# EAGLE design ReflowController_v1.1 (EAGLE 6.3)
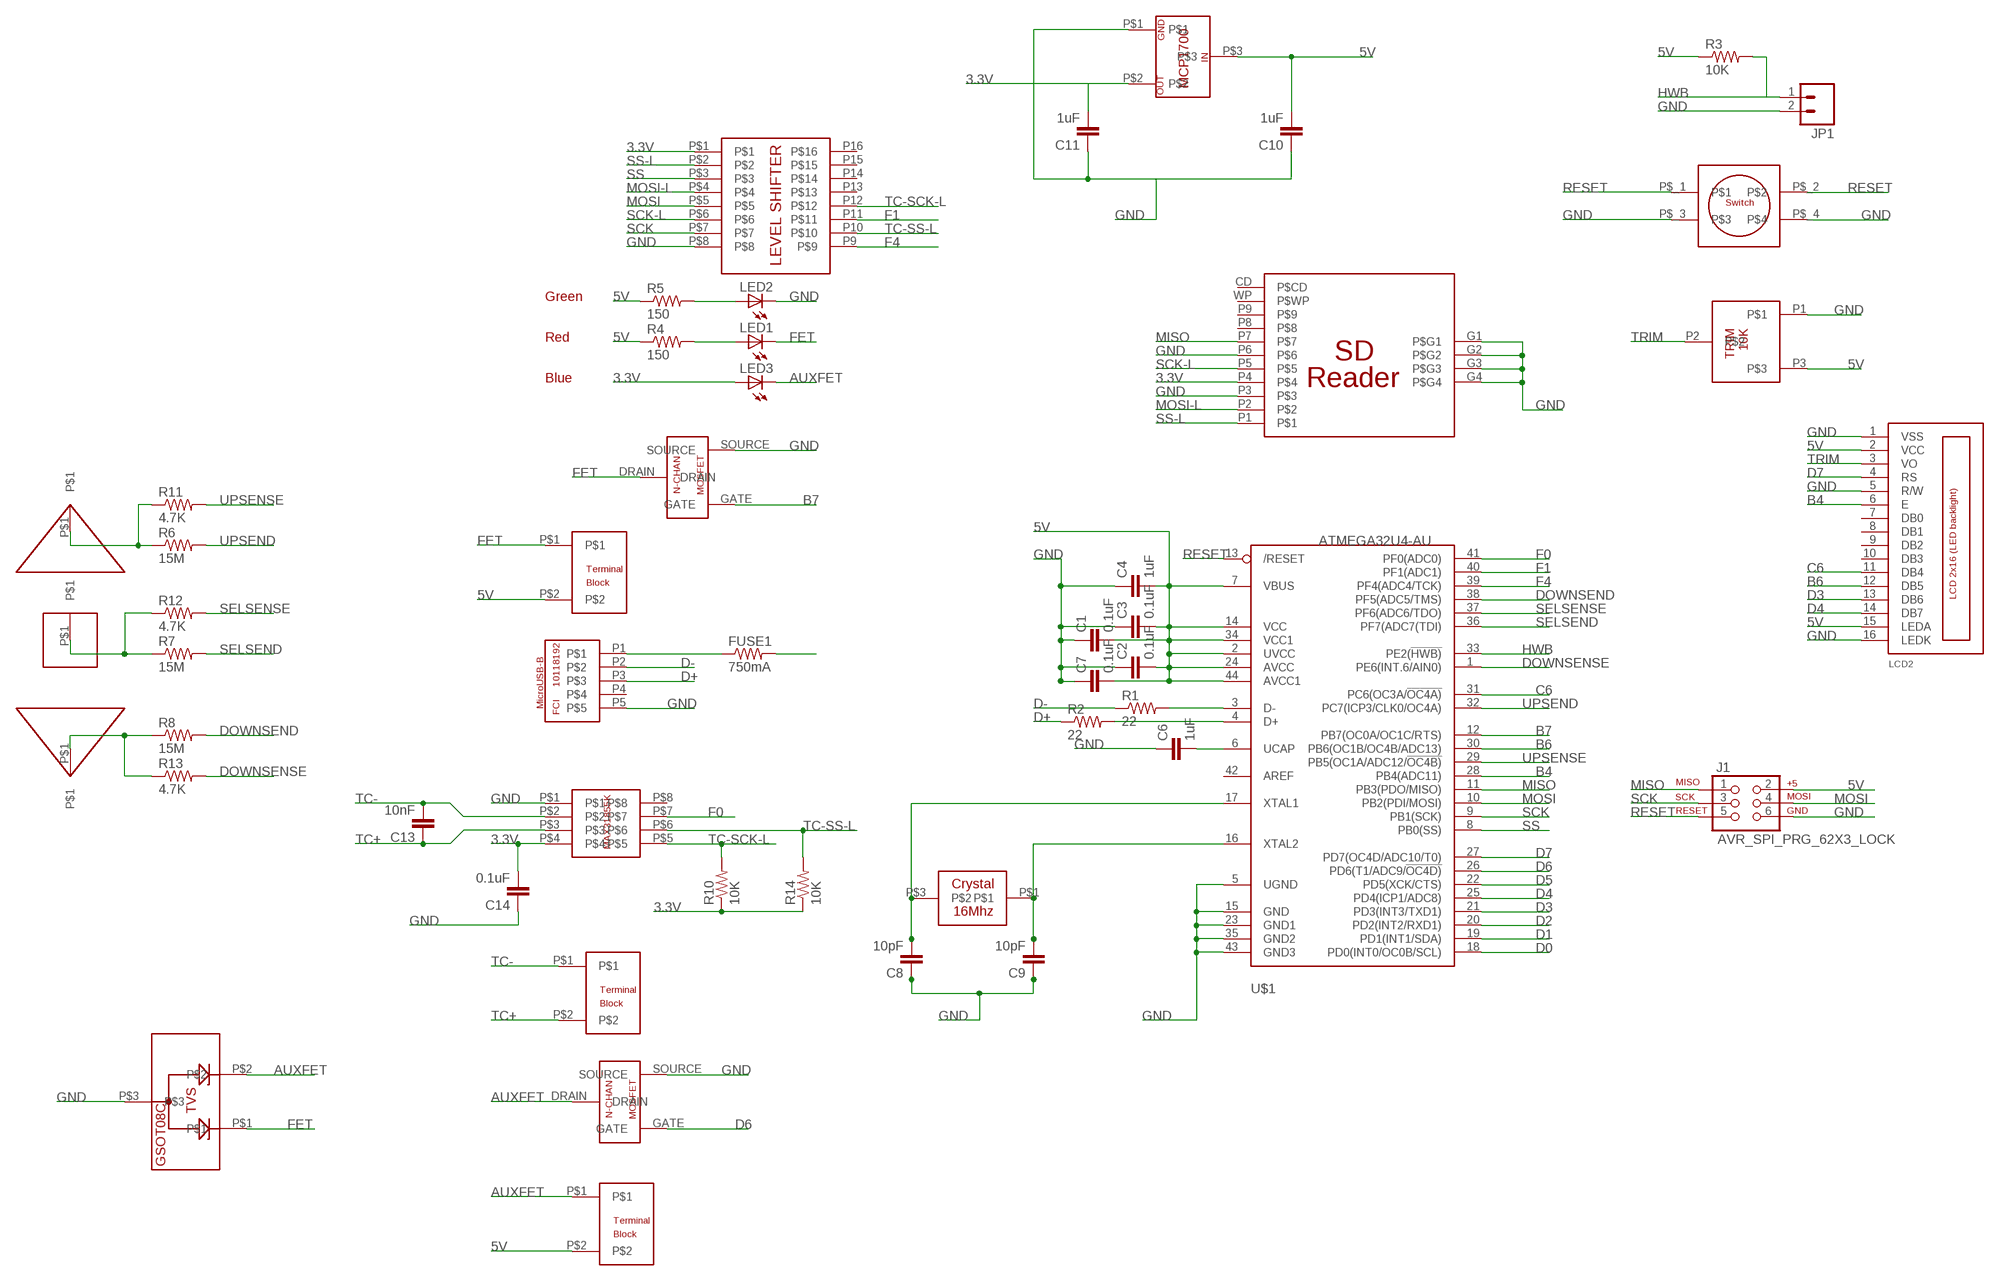
[diagram p0: schematic, sheet 1]

## Parts
C1  0.1uF  CAP0603-CAP  [0603-CAP]
C2  0.1uF  CAP0603-CAP  [0603-CAP]
C3  0.1uF  CAP0603-CAP  [0603-CAP]
C4  1uF  CAP0603-CAP  [0603-CAP]
C6  1uF  CAP0603-CAP  [0603-CAP]
C7  0.1uF  CAP0603-CAP  [0603-CAP]
C8  10pF  CAP0603-CAP  [0603-CAP]
C9  10pF  CAP0603-CAP  [0603-CAP]
C10  1uF  CAP0603-CAP  [0603-CAP]
C11  1uF  CAP0603-CAP  [0603-CAP]
C13  10nF  CAP0603-CAP  [0603-CAP]
C14  0.1uF  CAP0603-CAP  [0603-CAP]
FUSE1  750mA  RESISTOR0603-RES  [0603-RES]
J1  AVR_SPI_PRG_62X3_LOCK  [2X3_LOCK]
JP1  M02PTH  [1X02]
LCD2  LCD_2X16_SIL  [HY-1602F]
LED1  LED0603  [LED-0603]
LED2  LED0603  [LED-0603]
LED3  LED0603  [LED-0603]
R1  22  RESISTOR0603-RES  [0603-RES]
R2  22  RESISTOR0603-RES  [0603-RES]
R3  10K  RESISTOR0603-RES  [0603-RES]
R4  150  RESISTOR0603-RES  [0603-RES]
R5  150  RESISTOR0603-RES  [0603-RES]
R6  15M  RESISTOR0603-RES  [0603-RES]
R7  15M  RESISTOR0603-RES  [0603-RES]
R8  15M  RESISTOR0603-RES  [0603-RES]
R10  10K  RESISTOR0603-RES  [0603-RES]
R11  4.7K  RESISTOR0603-RES  [0603-RES]
R12  4.7K  RESISTOR0603-RES  [0603-RES]
R13  4.7K  RESISTOR0603-RES  [0603-RES]
R14  10K  RESISTOR0603-RES  [0603-RES]
U$1  ATMEGA32U4-AU  [TQFP44]
U$2  16MHZ-CRYSTAL_NX3225GA-16.000M-STD-CRG-1  [16MHZ-CRYSTAL_NX3225GA-16.000M-STD-CRG-1]
U$3  USB-B_10118192-0001LF  [USB-B_10118192-0001LF]
U$4  SDREADER_2041021-4  [SDREADER_2041021-4]
U$5  2POS_TERM_ED2748-ND  [2POS_TERM_ED2748-ND]
U$6  N-MOSFET630_DMG1012T-7DICT-ND  [N-MOSFET630_DMG1012T-7DICT-ND]
U$7  2POS_TERM_ED2748-ND  [2POS_TERM_ED2748-ND]
U$8  NXP_LVL_SHIFT_74HC4050D,653  [NXP_LVL_SHIFT_74HC4050D,653]
U$9  MAX_TC_MAX31855KASA+  [MAX_TC_MAX31855KASA+]
U$10  10K_TRIM_3362F-1-103LF  [10K_TRIM_3362F-1-103LF]
U$11  MCP1700__LDO  [MCP1700__LDO]
U$12  MOM-SWITCH-EG4620CT-ND  [MOM-SWITCH-EG4620CT-ND]
U$13  CAPTOUCH_ARROW  [CAPTOUCH_ARROW]
U$14  CAPTOUCH_ARROW  [CAPTOUCH_ARROW]
U$15  CAPTOUCH_SQUARE  [CAPTOUCH_SQUARE]
U$16  N-MOSFET630_DMG1012T-7DICT-ND  [N-MOSFET630_DMG1012T-7DICT-ND]
U$17  2POS_TERM_ED2748-ND  [2POS_TERM_ED2748-ND]
U$18  TVS_DIODE_MATRIX_GSOT08C-GS08  [TVS_DIODE_MATRIX_GSOT08C-GS08]

## Nets
3.3V: C11.2 C14.2 LED3.A R10.1 R14.1 U$4.P4 U$8.P$1 U$9.P$4 U$11.P$2
5V: C1.2 C2.2 C3.2 C4.2 C7.2 C10.2 FUSE1.2 J1.2 LCD2.2(VCC) LCD2.15(LEDA) R3.1 R4.1 R5.1 U$1.2(UVCC) U$1.7(VBUS) U$1.14(VCC) U$1.24(AVCC) U$1.34(VCC1) U$1.44(AVCC1) U$5.P$2 U$10.P3 U$11.P$3 U$17.P$2
AUXFET: LED3.C U$16.DRAIN U$17.P$1 U$18.P$2
B4: LCD2.6(E) U$1.28(PB4(ADC11))
B6: LCD2.12(DB5) U$1.30(PB6(OC1B/OC4B/ADC13))
B7: U$1.12(PB7(OC0A/OC1C/RTS)) U$6.GATE
C6: LCD2.11(DB4) U$1.31(PC6(OC3A/!OC4A))
D0: U$1.18(PD0(INT0/OC0B/SCL))
D1: U$1.19(PD1(INT1/SDA))
D2: U$1.20(PD2(INT2/RXD1))
D3: LCD2.13(DB6) U$1.21(PD3(INT3/TXD1))
D4: LCD2.14(DB7) U$1.25(PD4(ICP1/ADC8))
D5: U$1.22(PD5(XCK/CTS))
D6: U$1.26(PD6(T1/ADC9/!OC4D)) U$16.GATE
D7: LCD2.4(RS) U$1.27(PD7(OC4D/ADC10/T0))
D+: R2.1 U$3.P3
D-: R1.1 U$3.P2
DOWNSEND: R8.2 U$1.38(PF5(ADC5/TMS))
DOWNSENSE: R13.2 U$1.1(PE6(INT.6/AIN0))
F0: U$1.41(PF0(ADC0)) U$9.P$7
F1: U$1.40(PF1(ADC1)) U$8.P11
F4: U$1.39(PF4(ADC4/TCK)) U$8.P9
FET: LED1.C U$5.P$1 U$6.DRAIN U$18.P$1
GND: C1.1 C2.1 C3.1 C4.1 C6.1 C7.1 C8.1 C9.1 C10.1 C11.1 C14.1 J1.6 JP1.2 LCD2.1(VSS) LCD2.5(R/W) LCD2.16(LEDK) LED2.C U$1.5(UGND) U$1.15(GND) U$1.23(GND1) U$1.35(GND2) U$1.43(GND3) U$3.P5 U$4.G1(P$G1) U$4.G2(P$G2) U$4.G3(P$G3) U$4.G4(P$G4) U$4.P3 U$4.P6 U$6.SOURCE U$8.P$8 U$9.P$1 U$10.P1 U$11.P$1 U$12.P$_3 U$12.P$_4 U$16.SOURCE U$18.P$3
HWB: JP1.1 R3.2 U$1.33(PE2(!HWB))
MISO: J1.1 U$1.11(PB3(PDO/MISO)) U$4.P7
MOSI: J1.4 U$1.10(PB2(PDI/MOSI)) U$8.P$5
MOSI-L: U$4.P2 U$8.P$4
N$1: C8.2 U$1.17(XTAL1) U$2.P$3
N$2: C9.2 U$1.16(XTAL2) U$2.P$1
N$3: LED1.A R4.2
N$4: LED2.A R5.2
N$5: FUSE1.1 U$3.P1
N$7: R1.2 U$1.3(D-)
N$8: C6.2 U$1.6(UCAP)
N$9: R2.2 U$1.4(D+)
N$15: R6.1 R11.1 U$13.P$1
N$16: R7.1 R12.1 U$15.P$1
N$17: R8.1 R13.1 U$14.P$1
RESET: J1.5 U$1.13(/RESET) U$12.P$_1 U$12.P$_2
SCK: J1.3 U$1.9(PB1(SCK)) U$8.P$7
SCK-L: U$4.P5 U$8.P$6
SELSEND: R7.2 U$1.36(PF7(ADC7(TDI))
SELSENSE: R12.2 U$1.37(PF6(ADC6/TDO))
SS: U$1.8(PB0(SS)) U$8.P$3
SS-L: U$4.P1 U$8.P$2
TC+: C13.1 U$7.P$2 U$9.P$3
TC-: C13.2 U$7.P$1 U$9.P$2
TC-SCK-L: R10.2 U$8.P12 U$9.P$5
TC-SS-L: R14.2 U$8.P10 U$9.P$6
TRIM: LCD2.3(VO) U$10.P2
UPSEND: R6.2 U$1.32(PC7(ICP3/CLK0/OC4A))
UPSENSE: R11.2 U$1.29(PB5(OC1A/ADC12/!OC4B))
Unconnected: LCD2.7(DB0) LCD2.8(DB1) LCD2.9(DB2) LCD2.10(DB3) U$1.42(AREF) U$3.P4 U$4.CD(P$CD) U$4.P8 U$4.P9 U$4.WP(P$WP) U$8.P13 U$8.P14 U$8.P15 U$8.P16 U$9.P$8

## Notes on the sheet
- Green
- Red
- Blue

## Library data of the parts
C1-C4 C6-C11 C13 C14 = SparkFun-Capacitors:CAP: Capacitor Standard 0603 ceramic capacitor, and 0.1" leaded capacitor.
FUSE1 R1-R8 R10-R14 = SparkFun-Passives:RESISTOR: Resistor Basic schematic elements and footprints for 0603, 1206, and PTH resistors.
J1 = SparkFun-Connectors:AVR_SPI_PRG_6: AVR ISP 6 Pin This is the reduced ISP connector for AVR programming. Common on Arduino. This footprint will take up less PCB space and can be used with a 10-pin to 6-pin adapter such as SKU: BOB-08508
JP1 = SparkFun-Connectors:M02: Header 2 Standard 2-pin 0.1" header. Use with straight break away headers (SKU : PRT-00116), right angle break away headers (PRT-00553), swiss pins (PRT-00743), machine pins (PRT-00117), and female headers (PRT-00115). Molex polarized connector foot print use with SKU : PRT-08233 with associated crimp pins and housings.
LCD2 = lcd_2x16_led_backlight:LCD_2X16_SIL
LED1-LED3 = SparkFun-LED:LED: LEDs Standard schematic elements and footprints for 5mm, 3mm, 1206, and 0603 sized LEDs. 5mm - Spark Fun Electronics SKU : COM-00529 (and others)
U$1 = adafruit:ATMEGA32U4: http://www.ladyada.net/library/eagle
U$2 = JKCustom:16MHZ-CRYSTAL_NX3225GA-16.000M-STD-CRG-1
U$3 = JKCustom:USB-B_10118192-0001LF
U$4 = JKCustom:SDREADER_2041021-4
U$5 U$7 U$17 = JKCustom:2POS_TERM_ED2748-ND
U$6 U$16 = JKCustom:N-MOSFET630_DMG1012T-7DICT-ND
U$8 = JKCustom:NXP_LVL_SHIFT_74HC4050D,653
U$9 = JKCustom:MAX_TC_MAX31855KASA+
U$10 = JKCustom:10K_TRIM_3362F-1-103LF
U$11 = JKCustom:MCP1700__LDO
U$12 = JKCustom:MOM-SWITCH-EG4620CT-ND
U$13 U$14 = JKCustom:CAPTOUCH_ARROW
U$15 = JKCustom:CAPTOUCH_SQUARE
U$18 = JKCustom:TVS_DIODE_MATRIX_GSOT08C-GS08

## Board
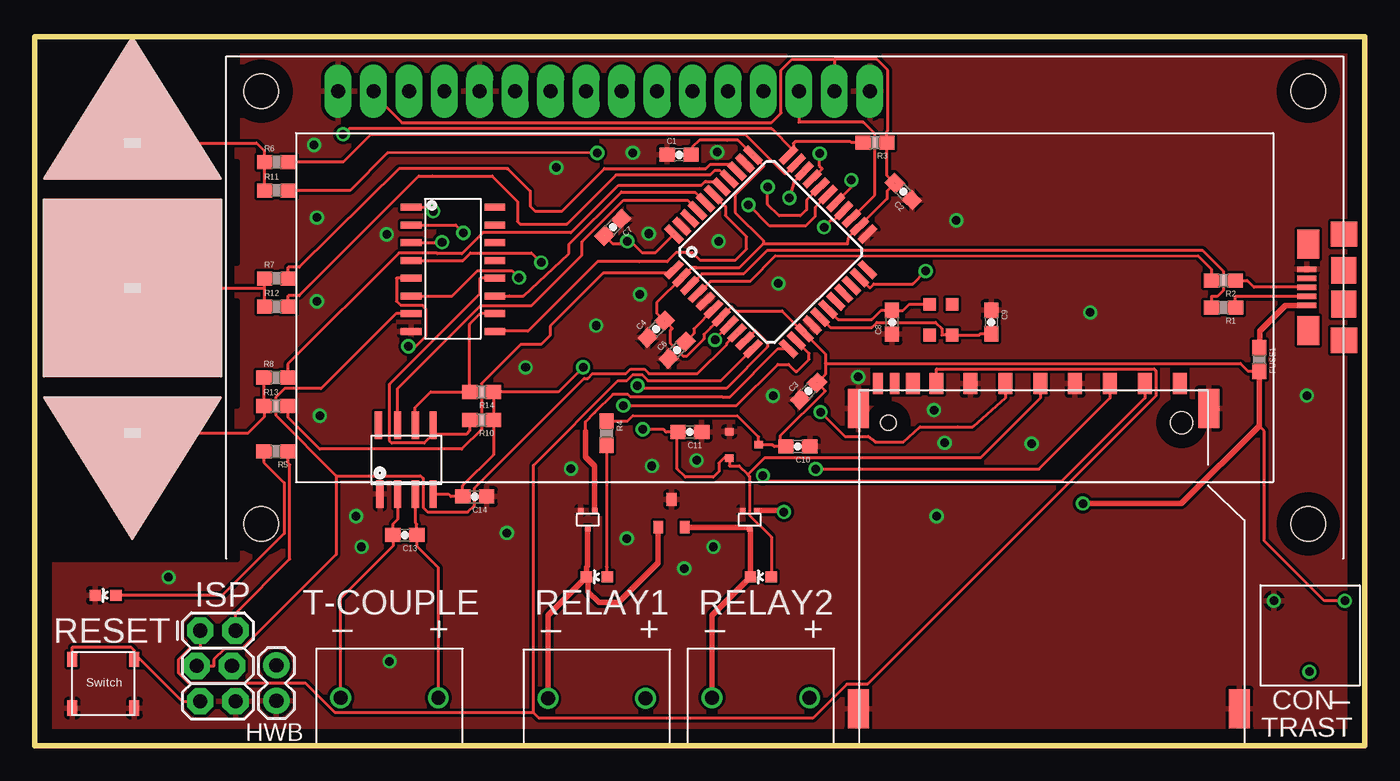
[diagram p1: board, top side]
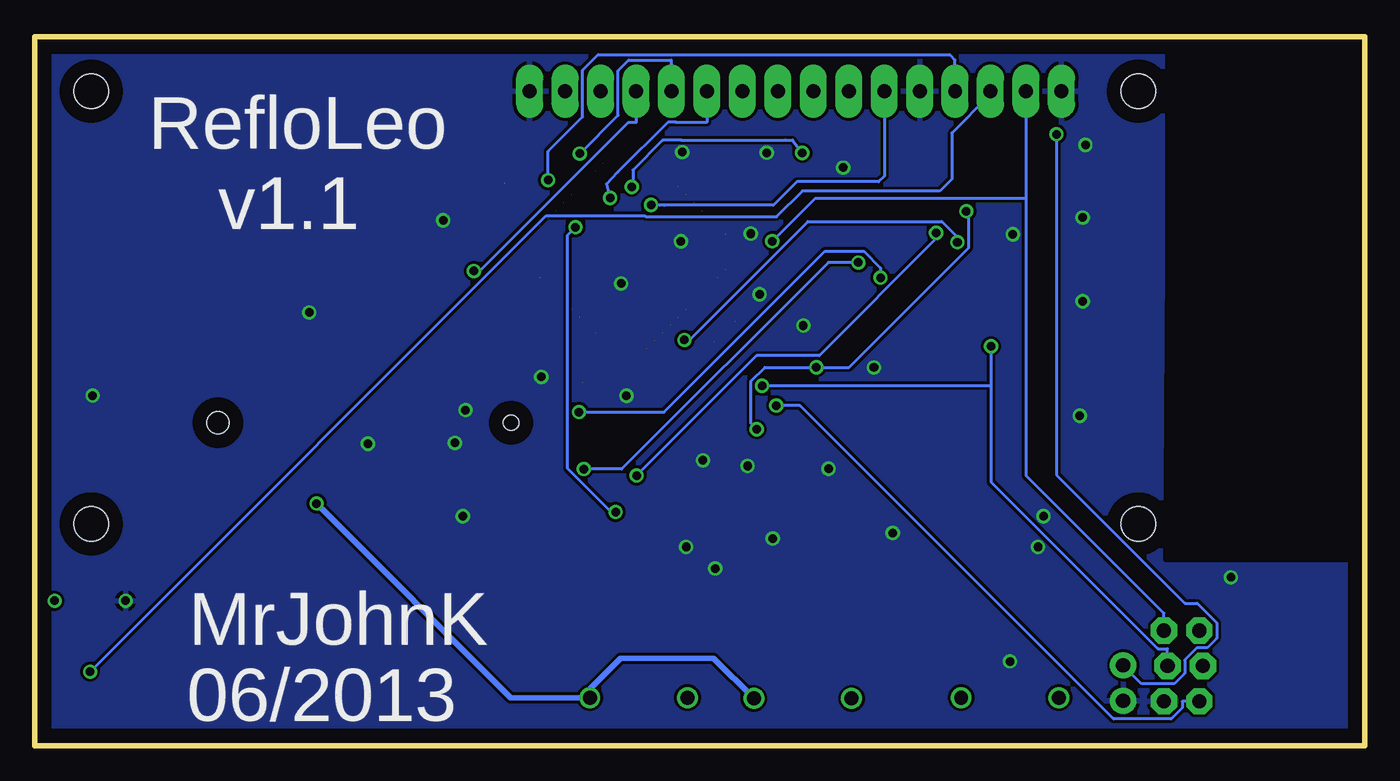
[diagram p2: board, bottom side, seen from below]

Size 95.25 x 50.8 mm. Coordinates in mm from the lower left corner, seen from the top.
Outline: 95.25,0 95.25,50.8 0,50.8 0,0 95.25,0
Copper layers (1*16): Top 0.035mm / dielectric 1.5mm / Bottom 0.035mm
Design rules "default *": minimum track width 8mil, minimum drill 24mil, track to track 8mil, track to pad 8mil, pad to pad 8mil, via to via 8mil, smd to smd 8mil, copper to edge 40mil, drill to drill 8mil, minimum pad ring 8mil, minimum via ring 8mil, stop-mask expansion 4mil, vias tented up to drill 0mil, thermal gap 10mil
tRestrict: area 0,13.3 to 14.5,21.1; area 0,24.3 to 14.5,31.8; area 0.2,34.6 to 14.5,41.8; area 0,43.8 to 14.5,50.6
bRestrict: area 0.2,13.3 to 14.2,50.6

### Footprints (pad centres in the part's own frame; a part is rotated, then mirrored left to right if it is on the bottom)
0603-CAP = smd 1.1 x 1: 1 -0.85,0; 2 0.85,0
0603-RES = smd 1.1 x 1: 1 -0.85,0; 2 0.85,0
2X3_LOCK = drill 1.016 pad 1.88 octagon: 1 0,0; 2 0,2.54; 3 2.54,-0.254; 4 2.54,2.286; 5 5.08,0; 6 5.08,2.54
1X02 = drill 1.016 pad 1.88: 1 0,0; 2 2.54,0
HY-1602F = drill 1 pad 1.93 long: 1 2.54,0; 2 5.08,0; 3 7.62,0; 4 10.16,0; 5 12.7,0; 6 15.24,0; 7 17.78,0; 8 20.32,0; 9 22.86,0; 10 25.4,0; 11 27.94,0; 12 30.48,0; 13 33.02,0; 14 35.56,0; 15 38.1,0; 16 40.64,0 | hole 2.5: -2.96,0; 72.04,0; -2.96,-31; 72.04,-31
LED-0603 = smd 0.8 x 0.8: A 0,-0.75; C 0,0.75
TQFP44 = smd 1.5 x 0.5: 1 -5.8,4; 2 -5.8,3.2; 3 -5.8,2.4; 4 -5.8,1.6; 5 -5.8,0.8; 6 -5.8,0; 7 -5.8,-0.8; 8 -5.8,-1.6; 9 -5.8,-2.4; 10 -5.8,-3.2; 11 -5.8,-4; 23 5.8,-4; 24 5.8,-3.2; 25 5.8,-2.4; 26 5.8,-1.6; 27 5.8,-0.8; 28 5.8,0; 29 5.8,0.8; 30 5.8,1.6; 31 5.8,2.4; 32 5.8,3.2; 33 5.8,4 | smd 0.5 x 1.5: 12 -4,-5.8; 13 -3.2,-5.8; 14 -2.4,-5.8; 15 -1.6,-5.8; 16 -0.8,-5.8; 17 0,-5.8; 18 0.8,-5.8; 19 1.6,-5.8; 20 2.4,-5.8; 21 3.2,-5.8; 22 4,-5.8; 34 4,5.8; 35 3.2,5.8; 36 2.4,5.8; 37 1.6,5.8; 38 0.8,5.8; 39 0,5.8; 40 -0.8,5.8; 41 -1.6,5.8; 42 -2.4,5.8; 43 -3.2,5.8; 44 -4,5.8
16MHZ-CRYSTAL_NX3225GA-16.000M-STD-CRG-1 = smd 0.9 x 0.9: P$1 -1.1,-0.8; P$3 1.1,0.8; P$NC_2 1.1,-0.8; P$NC_4 -1.1,0.8
USB-B_10118192-0001LF = smd 0.4 x 1.35: P1 -1.3,2.65; P2 -0.65,2.65; P3 0,2.65; P4 0.65,2.65; P5 1.3,2.65 | smd 1.8 x 1.9: P$1_NC -3.8,0; P$2_NC 3.8,0 | smd 1.9 x 1.8: P$3_NC -1.2,0; P$4_NC 1.2,0 | smd 2.1 x 1.6: P$5_NC -3.1,2.55; P$6_NC 3.1,2.55
SDREADER_2041021-4 = smd 0.7 x 1.5: CD -11.05,24.7; WP -12.25,24.7 | smd 1.5 x 2.8: G1 11.45,22.9; G2 13.65,1.4; G3 -13.65,1.4; G4 -13.65,22.9 | smd 1 x 1.5: P1 6.875,24.7; P2 4.375,24.7; P3 1.875,24.7; P4 -0.625,24.7; P5 -3.125,24.7; P6 -5.625,24.7; P7 -8.05,24.7; P8 -9.75,24.7; P9 9.375,24.7 | hole 1.1: -11.5,21.9 | hole 1.6: 9.5,21.9
2POS_TERM_ED2748-ND = drill 1: P$1 0,0; P$2 7,0
N-MOSFET630_DMG1012T-7DICT-ND = smd 0.4 x 0.4: DRAIN 0,1.3; GATE -0.5,0; SOURCE 0.5,0
NXP_LVL_SHIFT_74HC4050D,653 = smd 0.5 x 1.5: P9 8.89,6; P10 7.62,6; P11 6.35,6; P12 5.08,6; P13 3.81,6; P14 2.54,6; P15 1.27,6; P16 0,6; P$1 0,0; P$2 1.27,0; P$3 2.54,0; P$4 3.81,0; P$5 5.08,0; P$6 6.35,0; P$7 7.62,0; P$8 8.89,0
MAX_TC_MAX31855KASA+ = smd 1.98 x 0.53: P$1 0,0; P$2 0,-1.27; P$3 0,-2.54; P$4 0,-3.81; P$5 4.93,-3.81; P$6 4.93,-2.54; P$7 4.93,-1.27; P$8 4.93,0.1
10K_TRIM_3362F-1-103LF = drill 0.6: P1 -2.54,5.08; P2 0,0; P3 2.54,5.08
MCP1700__LDO = smd 0.54 x 0.62: P$1 0,0; P$2 1.9,0; P$3 0.95,2.1
MOM-SWITCH-EG4620CT-ND = smd 0.7 x 1.1: P$_1 -2.225,3.95; P$_2 2.225,3.95; P$_3 -2.225,0.45; P$_4 2.225,0.45
CAPTOUCH_ARROW = smd 1.27 x 0.635: P$1 0,2.54
CAPTOUCH_SQUARE = smd 1.27 x 0.635: P$1 0,0
TVS_DIODE_MATRIX_GSOT08C-GS08 = smd 0.7 x 0.9: P$1 -0.95,0; P$2 0.95,0; P$3 0,2

### Placement (x,y rotation side)
C1  46.15,42.34 0 top
C2  62.21,39.7 135 top
C3  55.42,25.4 45 top
C4  44.5,29.84 45 top
C6  46,28.34 45 top
C7  41.4,37.14 225 top
C8  61.4,30.34 90 top
C9  68.51,30.35 270 top
C10  54.65,21.43 180 top
C11  46.92,22.47 180 top
C13  26.5,15.09 180 top
C14  31.5,17.84 180 top
FUSE1  87.71,27.66 270 top
J1  11.83,8.25 270 top
JP1  17.29,5.75 270 top
LCD2  19.17,46.89 0 top
LED1  40.25,12.09 90 top
LED2  5.06,10.77 90 top
LED3  52,12.09 90 top
R1  85.15,31.39 180 top
R2  85.14,33.33 180 top
R3  60.18,43.21 180 top
R4  40.95,22.38 270 top
R5  17.25,21.09 180 top
R6  17.3,41.81 0 top
R7  17.3,33.48 0 top
R8  17.26,26.37 0 top
R10  32,23.34 180 top
R11  17.3,39.78 0 top
R12  17.3,31.45 0 top
R13  17.26,24.34 0 top
R14  32,25.34 180 top
U$1  52.7,35.37 45 top
U$2  64.91,30.52 90 top
U$3  93.77,32.84 90 top
U$4  72.64,1.24 0 top
U$5  36.75,3.38 0 top
U$6  39.6,16.84 180 top
U$7  21.9,3.44 0 top
U$8  26.94,38.57 270 top
U$9  24.71,18.02 90 top
U$10  91.3,5.3 0 top
U$11  49.74,22.51 270 top
U$12  4.9,2.24 0 top
U$13  6.99,40.64 0 top
U$14  6.99,24.94 180 top
U$15  6.99,32.79 0 top
U$16  51.2,16.84 180 top
U$17  48.5,3.44 0 top
U$18  45.6,15.64 0 top

### Tracks (layer width: path | path; a pad name or v marks a point on that pad's centre or on a via)
3.3V  (via drill 0.61 pad 1.02)
  Top 0.203: 51.07,19.42 51.2,19.29 51.2,16.5 52.75,14.95 LED3.A | 51.07,19.42 50.45,20.05 49.74,20.05 U$11.P$2 49.37,20.61 49,20.24 49,19.64 48.6,19.24 46.6,19.24 46,19.84 46,22.41 C11.2 45.22,22.47 45.02,22.67 v43.54,22.67 | 51.07,19.42 52.29,20.64 67.75,20.64 72.01,24.9 U$4.P4 | U$8.P$1 27.99,38.57 28.27,38.29 v28.53,38.29 | v39.28,27.11 37.51,25.34 R14.1 R10.1 32.85,20.83 30.65,18.63 C14.2 29.81,17.84 29.63,18.02 U$9.P$4
  Bottom 0.203: v28.53,38.29 28.36,38.13 28.36,35.69 36.94,27.11 v39.28,27.11 42.97,27.11 43.96,26.12 43.96,23.1 v43.54,22.67
5V  (via drill 0.6, 0.61 pad 1.02)  (10 unrouted)
  Top 0.203: R5.1 18.1,20.3 18.26,20.14 18.26,13.36 14.37,9.48 J1.2 | 57.27,49.18 LCD2.15 | LCD2.2 24.25,46.67 26.3,44.62 52.75,44.62 53.46,45.33 53.46,48.41 54.23,49.18 57.27,49.18 | 57.27,49.18 60.31,49.18 61.1,48.39 61.1,44.08 61.03,44.01 R3.1 61.03,40.91 61.01,40.89 C2.2 61.05,39.74 61.05,39.19 U$1.24 58.33,36.48 58.21,35.95 54.3,35.95 53.17,35.97 52.92,35.97 52.18,35.98 | 53.38,21.43 53.38,22.19 56.58,25.39 56.58,25.44 C3.2 56.61,26.6 56.61,27.38 | 53.38,21.43 52.96,21.43 52.84,21.56 U$11.P$3 51.84,22.12 50.32,23.63 42.85,23.65 42.43,23.23 R4.1 | C10.2 53.38,21.43 | 47.38,34.27 47.08,34.27 | 47.08,34.27 U$1.2 44.54,31.74 44.54,31 C4.2 45.66,29.88 45.54,29.76 45.54,28.8 46.45,27.89 46.68,27.89 47.93,29.14 47.93,29.47 48.43,29.97 48.8,30.34 U$1.7 49.9,31.44 50.19,31.15 53.53,31.15 U$1.14 55.84,28.84 56.61,28.07 56.61,27.38 | 56.61,27.38 86.35,27.38 86.92,26.82 FUSE1.2 | C7.2 41.36,35.98 42.27,35.98 v42.43,36.14 42.68,36.14 43.52,35.3 44.43,35.3 U$1.44 | U$1.34 51.01,42.81 | U$1.34 52.22,41.53 50.32,39.63 50.15,39.46 50.15,38.21 52.18,36.18 52.18,35.98 | 47.08,34.27 50.48,34.27 52.18,35.98 | U$1.34 50.36,43.38 49.58,43.38 47.59,43.38 47.09,42.87 47.09,42.43 C1.2 | U$10.P3 92.36,10.38 88.06,14.68 88.06,22.54 87.7,22.91
  Top 0.406: v75.08,17.35 82.14,17.35 87.7,22.91 87.7,26.8 FUSE1.2
  Bottom 0.203: 24.25,39.19 24.25,19.36 14.37,9.48 J1.2 | LCD2.2 24.25,39.19 | 24.25,39.19 39.39,39.19 v42.43,36.14
  Bottom 0.406: v75.08,17.35 61.17,3.44 U$17.P$2 55.5,4.07 53.31,6.26 46.63,6.26 U$5.P$2
AUXFET
  Top 0.406: U$17.P$1 48.5,9.34 LED3.C 51.25,15.49 U$16.DRAIN 51.1,15.64 U$18.P$2
B4  (via drill 0.61 pad 1.02)  (1 unrouted)
  Top 0.203: U$1.28 55.88,38.55 55.88,37.92 55.2,37.24 53.2,37.24 52.62,37.24 v51.11,38.75
  Bottom 0.203: LCD2.6 34.41,46.67 34.41,40.82 34.82,40.41 40.67,40.41 42.35,38.73 50.18,38.73 50.5,38.73 v51.11,38.75
B6  (via drill 0.61 pad 1.02)
  Top 0.203: U$1.30 56.41,41.34 56.22,41.54 v56.22,42.43 | U$1.30 | U$1.30
  Bottom 0.203: LCD2.12 49.65,49.11 52.72,49.11 53.47,48.36 53.47,45.17 v56.22,42.43
B7
  Top 0.203: U$1.12 53.24,28.44 49.79,24.99 49.25,24.99 42.66,24.99 42.47,25.17 41.41,25.17 40.1,23.86 39.44,23.2 39.44,22.5
  Top 0.406: U$6.GATE 40.1,20.04 39.45,20.69 39.45,22.5 39.44,22.5
C6  (via drill 0.61 pad 1.02)  (1 unrouted)
  Top 0.203: U$1.31 54.36,40.43 v54.05,39.25
  Bottom 0.203: LCD2.11 47.11,44.67 49.33,44.67 49.91,44.67 53.5,41.08 53.94,40.64 54.31,40.24 v54.05,39.25
D3  (via drill 0.61 pad 1.02)  (1 unrouted)
  Top 0.203: U$1.21 59.8,32.8 60.09,33.08 62.88,33.08 v63.81,34.01
  Bottom 0.203: LCD2.13 52.19,44.67 52.74,44.67 63.4,34.01 v63.81,34.01
D4  (1 unrouted)
  Top 0.203: LCD2.14 54.73,44.67 59.34,44.67 60.17,43.84 60.17,39.45 U$1.25
D6  (via drill 0.61 pad 1.02)  (1 unrouted)
  Top 0.203: U$1.26 57.2,37.61 56.99,37.61 v56.53,37.15 | 53.55,16.84 v53.65,16.74
  Top 0.406: U$16.GATE 53.55,16.84
  Bottom 0.203: v53.65,16.74 53.99,16.74 57.11,19.86 57.11,36.58 v56.53,37.15
D7  (via drill 0.61 pad 1.02)  (1 unrouted)
  Top 0.203: U$1.27 58.49,40.03 v58.49,40.52
  Bottom 0.203: LCD2.4 29.33,49.11 29.72,49.51 54.9,49.51 56.01,48.4 56.01,45.06 58.49,42.59 v58.49,40.52
D+
  Top 0.203: R2.1 86.83,33.33 87.32,32.84 U$3.P3
D-
  Top 0.203: R1.1 86,32.18 86.01,32.19 U$3.P2
DOWNSEND  (1 unrouted)
  Top 0.203: U$1.38 48.72,40.49 arc-90 48.66,40.42 48.1,40.42 48,40.42 47.75,40.17 41.81,40.16 38.4,36.75 32.1,36.76 30.59,35.25 28.84,35.25 28.79,35.31 26.07,35.31 18.11,27.34 R8.2
DOWNSENSE  (1 unrouted)
  Top 0.203: R13.2 18.11,23.55 20.4,21.25 30.58,21.25 31.99,22.67 31.99,25.94 34.79,28.74 36.27,28.76 36.91,29.4 36.91,30.05 36.91,30.06 40.71,33.86 45.53,33.86 U$1.1
F0  (1 unrouted)
  Top 0.203: U$1.41 46.73,39.08 42.18,39.08 39.2,36.1 39.19,35.14 35.59,31.54 31.93,31.54 25.98,25.59 U$9.P$7
F1  (1 unrouted)
  Top 0.203: U$8.P11 33.99,32.22 35,32.22 38.26,35.26 38.26,35.93 42.01,39.67 47.3,39.65 U$1.40
F4  (1 unrouted)
  Top 0.203: U$1.39 49.34,38.74 49.45,38.62 49.45,37.99 50.16,37.29 50.99,36.46 50.99,35.59 50.19,34.8 47.63,34.8 47.09,35.34 46.59,35.34 45.94,35.34 45.3,34.71 45.3,34.67 43.28,34.67 40.29,34.67 35.31,29.69 32.95,29.69 U$8.P9
FET
  Top 0.203: 39.6,12.88 39.5,12.78
  Top 0.406: LED1.C 39.5,12.78 | U$6.DRAIN 39.6,12.88 | U$5.P$1 36.75,9.34 LED1.C | U$18.P$1 44.65,13.11 41.8,10.26 40.4,10.26 39.63,11.03 39.63,11.96 LED1.C
GND  (via drill 0.61 pad 1.02)
  other vias: 71.4,21.64 64.4,24.04 75.6,31.04 64.6,16.44 44.2,20.04 48.6,14.24 42.4,14.84 46.51,12.69 25.4,6.04 23.4,14.24 23,16.44 20.4,23.64 20,43.04 20.2,37.84 20.2,31.84 25.2,36.64 33.8,15.24 38.4,19.84 47.4,20.44 66,37.64 65.17,21.69 53.26,33.11 52.88,25.07 58.98,26.42 35.15,27.09 43.34,32.34 40.2,30.1 48.97,36.13 42.83,42.48 43.97,36.69 48.88,42.53 37.35,41.42 9.58,12.06 91.11,25.08
  pour Top: 0,0 95.25,0 95.25,50.8 14.48,50.8 14.48,13.17 0,13.17
  pour Bottom: 0,0 95.25,0 95.25,50.8 14.48,50.8 14.48,13.17 0,13.17
HWB  (via drill 0.61 pad 1.02)
  Top 0.203: R3.2 58.49,43.22 58.41,43.29 54.47,43.29 54.34,43.16 54.34,42.82 54.26,42.74 | v22.07,43.81 22.52,44.19 52.79,44.19 54.24,42.74 54.26,42.74 | 54.26,42.74 53.98,42.46 U$1.33
  Bottom 0.203: v22.07,43.81 22.07,19.4 12.87,10.2 12,10.2 10.6,8.8 10.6,7.69 11.27,7.02 12.02,7.02 12.89,6.15 12.89,5.19 13.63,4.44 15.98,4.44 JP1.1
MISO  (1 unrouted)
  Top 0.203: 35.7,2.37 35.7,20.09 41.78,26.16 42.4,26.16 42.83,26.59 43.49,26.59 43.92,26.16 49.15,26.16 U$1.11 | 35.7,2.37 36.1,1.97 55.72,1.97 58.16,4.41 59.66,4.41 80.3,25.06 80.3,26.86 80.17,26.99 64.58,26.99 U$4.P7 | 35.7,2.37 21.49,2.37 19.38,4.48 11.03,4.48 10.31,5.2 10.31,6.19 11.14,7.02 11.83,7.02 J1.1
MOSI  (via drill 0.61 pad 1.02)  (1 unrouted)
  Top 0.203: U$1.10 51.6,29.75 51.61,29.75 52.48,28.88 52.47,28.56 49.53,25.6 43.12,25.6 v43.16,25.79 | U$8.P$5 25.9,33.49 25.9,31.85 26.2,31.55 27.76,31.55 27.99,31.33 27.99,29.31 27.3,28.62 v26.76,28.62
  Bottom 0.203: 26.76,25.79 26.76,18.89 14.81,6.94 14.12,6.94 J1.4 | v26.76,28.62 26.76,25.79 | v43.16,25.79 26.76,25.79
MOSI-L  (via drill 0.61 pad 1.02)
  Top 0.203: U$4.P2 77.01,24.9 71.92,19.82 v55.93,19.82 | U$8.P$4 30.66,34.76 31.2,35.31 35.58,35.31 v36.26,34.62
  Bottom 0.203: v36.26,34.62 38.41,34.62 53.22,19.82 v55.93,19.82
N$1  (1 unrouted)
  Top 0.203: U$2.P$3 62.62,31.62 62.19,31.19 C8.2 60.61,31.19 59.95,30.54 57.54,30.54 U$1.17
N$2  (1 unrouted)
  Top 0.203: U$1.16 56.97,29.97 59.95,29.97 60.32,30.33 64.52,30.33 64.96,29.88 64.96,29.42 U$2.P$1 67.64,29.42 67.72,29.5 C9.2
N$3
  Top 0.203: LED1.A 41,12.78 40.95,12.83 R4.2
N$4
  Top 0.203: R5.2 16.4,20.3 17.86,18.84 17.86,15.2 13.43,10.77 LED2.A
N$5
  Top 0.406: U$3.P1 89.57,31.54 87.73,29.7 87.73,28.53 FUSE1.1
N$7
  Top 0.203: R1.2 84.3,32.18 84.69,32.18 85.13,32.62 85.13,33.99 83.63,35.49 52.47,35.5 50.77,33.8 47.78,33.8 46.95,32.97 U$1.3
N$8  (2 unrouted)
  Top 0.203: C6.2 47.2,29.54 47.2,29.87 U$1.6
N$9
  Top 0.203: R2.2 84.29,34.12 83.31,35.1 53.02,35.09 51.22,33.27 48.38,33.27 47.52,32.4 U$1.4
N$15
  Top 0.203: U$13.P$1 15.88,43.18 16.45,42.6 R6.1 R11.1
N$16
  Top 0.203: 16.45,32.79 R7.1 | R12.1 16.45,32.79 | 16.45,32.79 7.91,32.79 U$15.P$1
N$17
  Top 0.203: U$14.P$1 15.26,22.4 16.41,23.55 R13.1 R8.1
RESET  (via drill 0.61 pad 1.02)
  Top 0.203: v42.14,24.37 49.96,24.36 50.25,24.36 53.21,27.33 53.99,27.33 54.5,26.81 54.59,26.81 55.45,27.68 55.45,28.1 54.91,28.64 U$1.13 | 7.12,6.61 10.56,3.17 J1.5 | 7.12,6.61 7.12,6.82 6.91,7.03 2.67,7.03 U$12.P$_1 | U$12.P$_2 7.12,6.61
  Bottom 0.203: J1.5 13.06,3.17 13.06,2.71 13.85,1.92 18,1.92 40.45,24.37 v42.14,24.37
SCK  (1 unrouted)
  Top 0.203: 21.59,19.34 27.63,19.34 27.81,19.16 27.81,17.06 28.14,16.73 31.01,16.73 31.49,17.21 31.49,18.45 39.35,26.31 39.61,26.31 39.94,26.65 42.33,26.65 42.67,26.98 43.66,26.98 43.99,26.65 47.46,26.65 49.56,28.75 49.56,28.84 | 49.56,28.84 | U$8.P$7 25.86,30.95 20.49,25.58 17.87,25.58 17.25,24.95 17.25,23.68 21.59,19.34 | 21.59,19.34 21.59,13.7 14.83,6.94 13.58,6.94 12.81,6.17 12.81,5.71 J1.3 | U$1.9 49.56,28.84
SCK-L  (via drill 0.61 pad 1.02)
  Top 0.203: U$4.P5 69.51,24.9 67.18,22.85 66.09,22.84 63.4,22.84 62.2,21.75 60.2,21.75 59.68,22.16 58.01,22.16 v56.27,23.9 | U$8.P$6 29.89,32.22 31.71,34.04 34.17,34.04 v34.67,33.53
  Bottom 0.203: v56.27,23.9 50.17,23.9 38.64,35.43 35.87,35.43 34.67,34.23 v34.67,33.53
SELSEND
  Top 0.203: R7.2 18.15,34.27 18.95,34.27 26.09,41.36 33.49,41.36 33.79,41.36 33.87,41.36 35.48,39.75 35.48,38.65 35.84,38.3 37.75,38.3 40.8,41.35 47.64,41.35 48.06,41.35 48.38,41.66 49.75,41.66 49.76,41.67 50.26,41.17 U$1.36
SELSENSE
  Top 0.203: R12.2 18.15,32.24 18.95,32.24 27.5,40.81 28.46,40.81 32.76,40.81 34.57,38.99 34.57,37.56 34.76,37.37 38.11,37.37 41.56,40.82 41.63,40.89 48.37,40.89 48.72,41.23 49.06,41.23 49.69,40.61 U$1.37
SS  (via drill 0.61 pad 1.02)  (1 unrouted)
  Top 0.203: v29.17,36.07 29.13,36.03 27.99,36.03 U$8.P$3 | U$1.8 49,29.4 49,29.34 v48.73,29.07
  Bottom 0.203: v48.73,29.07 48.38,29.07 39.88,37.56 30.29,37.56 29.17,36.44 v29.17,36.07
SS-L  (via drill 0.61 pad 1.02)
  Top 0.203: U$4.P1 79.51,24.9 73.57,18.96 52.54,18.96 v52.15,19.35 | U$8.P$2 30.14,37.3 v30.69,36.75
  Bottom 0.203: v30.69,36.75 30.69,36.31 39.05,27.95 43.55,27.95 v52.15,19.35
TC+
  Top 0.203: U$7.P$2 28.9,12.75 27.35,14.3 C13.1 27.35,15.88 27.25,15.98 U$9.P$3
TC-
  Top 0.203: U$9.P$2 25.98,16.21 25.65,15.88 C13.2 25.65,14.3 21.9,10.55 U$7.P$1
TC-SCK-L
  Top 0.203: 28.52,22.31 27.88,21.67 25.57,21.67 25.43,21.82 25.43,25.9 31.9,32.38 31.9,33.49 U$8.P12 | 28.52,22.31 30.91,22.31 31.15,22.55 R10.2 | U$9.P$5 28.52,22.31
TC-SS-L
  Top 0.203: U$8.P10 31.9,30.95 31.15,30.2 R14.2 28.36,25.34 27.25,24.23 U$9.P$6
TRIM
  Bottom 0.203: U$10.P2 58.63,37.97 51.56,37.97 51.48,37.9 42.12,37.9 40.28,39.74 30.42,39.74 29.58,40.59 29.58,43.89 26.79,46.68 LCD2.3
UPSEND  (1 unrouted)
  Top 0.203: U$1.32 53.8,41 53.73,40.95 50.91,43.79 24.05,43.79 22.08,41.81 R6.2
UPSENSE  (via drill 0.61 pad 1.02)
  Top 0.203: v40.28,42.47 25.28,42.49 22.57,39.78 R11.2 | U$1.29 55.27,39.08 55.27,38.4 54.83,37.96 53.3,37.96 52.49,38.78 v52.49,40.04
  Bottom 0.203: v40.28,42.47 40.97,43.39 41.5,43.39 48.96,43.39 49.53,43.39 50.28,43.39 50.28,43.37 52.41,41.24 52.41,40.12 v52.49,40.04

### Text on the board
_tsilk: ISP | T-COUPLE | RELAY1 | RELAY2 | _ | _ | _ | RESET | + | + | + | _ | CON | HWB | TRAST
_bsilk: RefloLeo | v1.1 | MrJohnK | 06/2013